# EAGLE design fw_adapter (EAGLE 6.5.0)
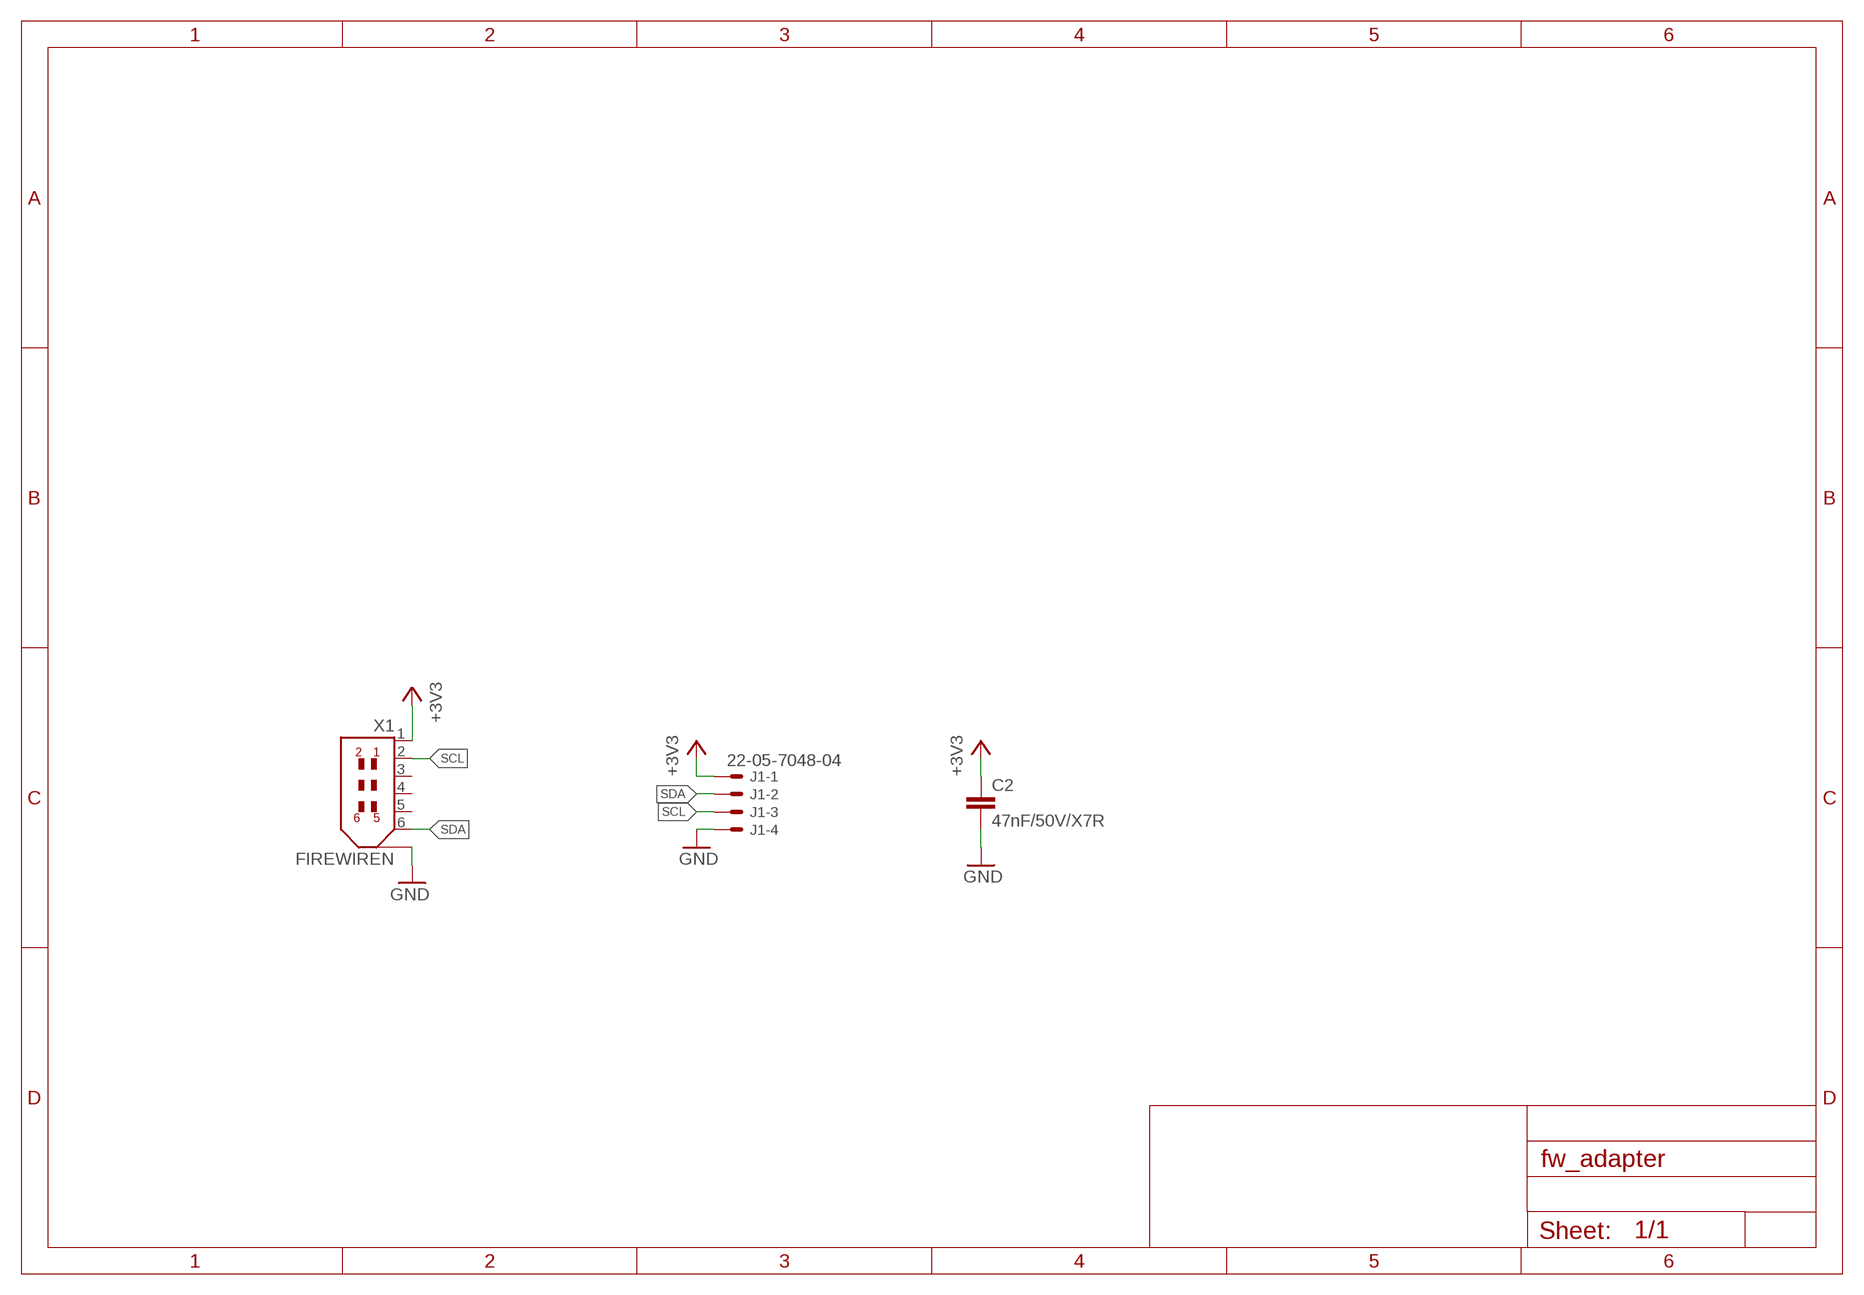
[diagram p0: schematic, sheet 1]

## Parts
C2  47nF/50V/X7R  C-EUC0603K  [C0603K]
J1  22-05-7048-04  [7395-04]
X1  FIREWIREN  [IEEE1394_90DEG_PINS_NORMAL]

## Nets
+3V3: C2.1 J1.1 X1.1
GND: C2.2 J1.4 X1.M1 X1.M2
SCL: J1.3 X1.2
SDA: J1.2 X1.6
Unconnected: X1.3 X1.4 X1.5

## Library data of the parts
C2 = rcl:C-EU: CAPACITOR, European symbol
J1 = con-molex:22-?-04: CONNECTOR wire to board 2.54 mm (.1 inch) pitch header; OC_FARNELL: unknown; OC_NEWARK: unknown
X1 = corona:FIREWIRE

## Board
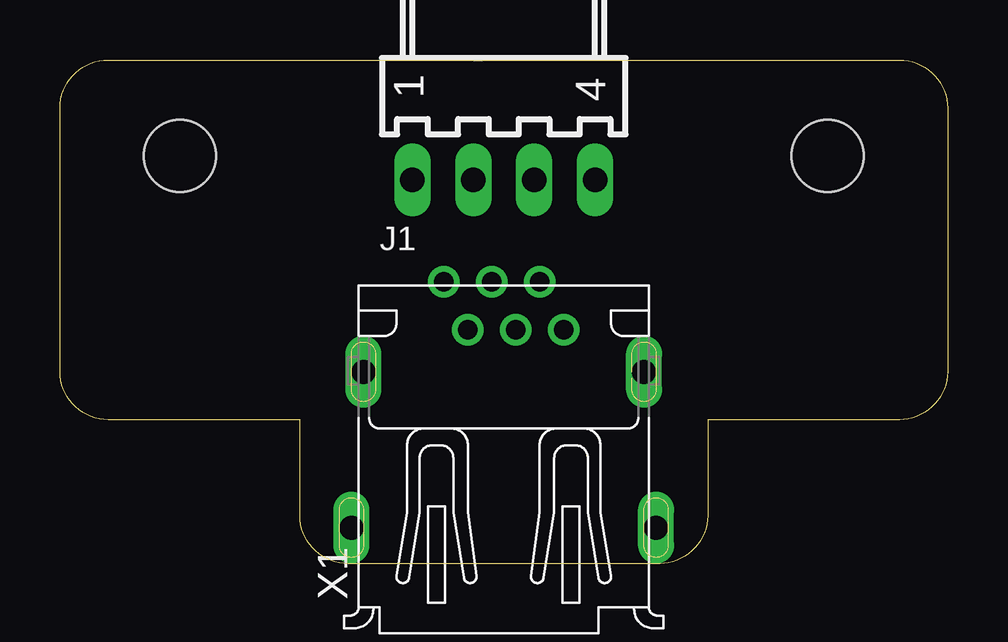
[diagram p1: board, top side]
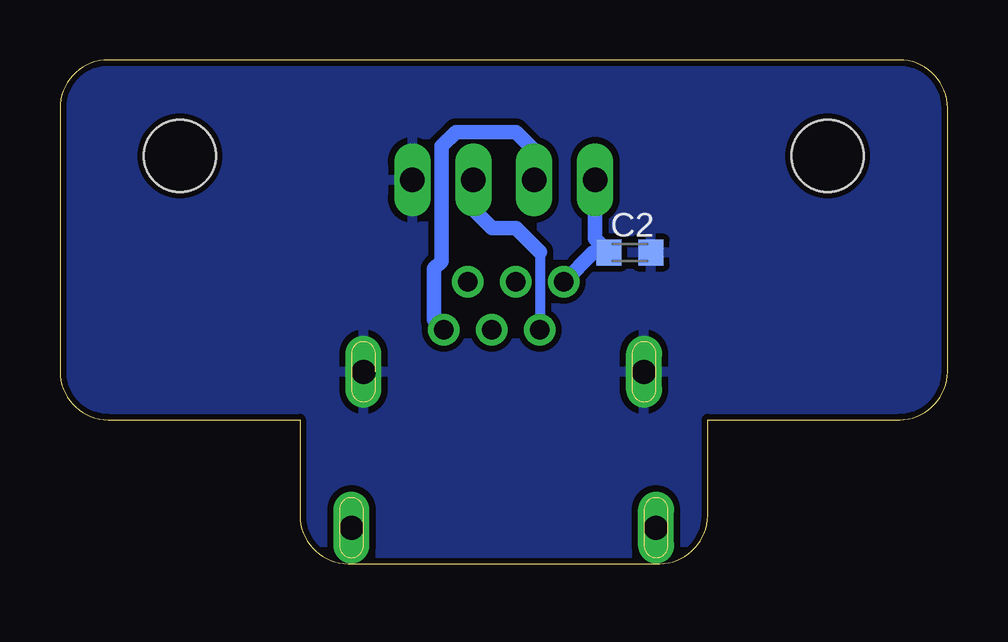
[diagram p2: board, bottom side, seen from below]

Size 37 x 21 mm. Coordinates in mm from the lower left corner, seen from the top.
Outline: 0,8 0,19 arc-90 2,21 35,21 arc-90 37,19 37,8 arc-90 35,6 27,6 27,2 arc-90 25,0 12,0 arc-90 10,2 10,6 2,6 arc-90 0,8
Copper layers (1*16): Top 0.035mm / dielectric 1.5mm / Bottom 0.035mm
Design rules "default *": minimum track width 10mil, minimum drill 24mil, track to track 8mil, track to pad 8mil, pad to pad 8mil, via to via 8mil, smd to smd 8mil, copper to edge 8mil, drill to drill 8mil, minimum pad ring 10mil, minimum via ring 8mil, stop-mask expansion 4mil, vias tented up to drill 0mil, thermal gap 10mil
Holes 3 mm at 5,17 32,17

### Footprints (pad centres in the part's own frame; a part is rotated, then mirrored left to right if it is on the bottom)
C0603K = smd 1.05 x 1.08: 1 -0.875,0; 2 0.875,0
7395-04 = drill 1.016 long: 1 3.81,0; 2 1.27,0; 3 -1.27,0; 4 -3.81,0
IEEE1394_90DEG_PINS_NORMAL = drill 0.8 pad 1.27: 1 -2.5,3.75; 2 -1.5,1.75; 3 -0.5,3.75; 4 0.5,1.75; 5 1.5,3.75; 6 2.5,1.75 | drill 1 pad 1.422 long: M1 -5.85,0; M2 5.85,0; M4 6.35,-6.5; M5 -6.35,-6.5

### Placement (x,y rotation side)
C2  13.24,12.97 0 bottom
J1  18.5,16 180 top
X1  18.5,8 0 top

### Tracks (layer width: path | path; a pad name or v marks a point on that pad's centre or on a via)
+3V3
  Bottom 0.61: J1.1 14.69,13.55 C2.1 14.78,12.97 X1.1
GND
  pour Bottom (isolate 0.254): 2,21 35,21 arc-90 37,19 37,8 arc-90 35,6 27,6 27,2 arc-90 25,0 12,0 arc-90 10,2 10,6 2,6 arc-90 0,8 0,19 arc-90
SCL
  Bottom 0.406: 17,13 X1.2
  Bottom 0.61: J1.3 19.77,14.77 19,14 18,14 17,13
SDA
  Bottom 0.61: J1.2 17.23,17.23 18,18 20.5,18 21.1,17.4 21.1,12.6 21.4,12.3 21.4,10.15 X1.6